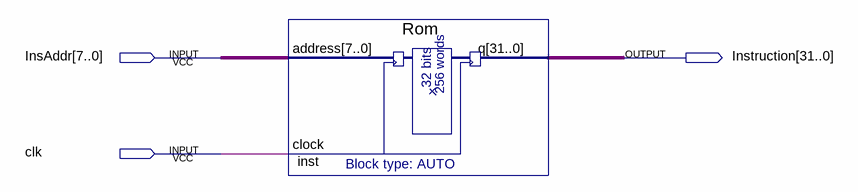
[diagram p0: schematic sheet]
// Quartus schematic ROM_INS.bdf as structural Verilog: 1 symbols, 3 pins
module ROM_INS (
  input  [7:0] InsAddr,
  input  clk,
  output [31:0] Instruction
);

  Rom inst (.address(InsAddr), .clock(clk), .q(Instruction));
endmodule
